# Altium schematic sheet core.SchDoc
size A4
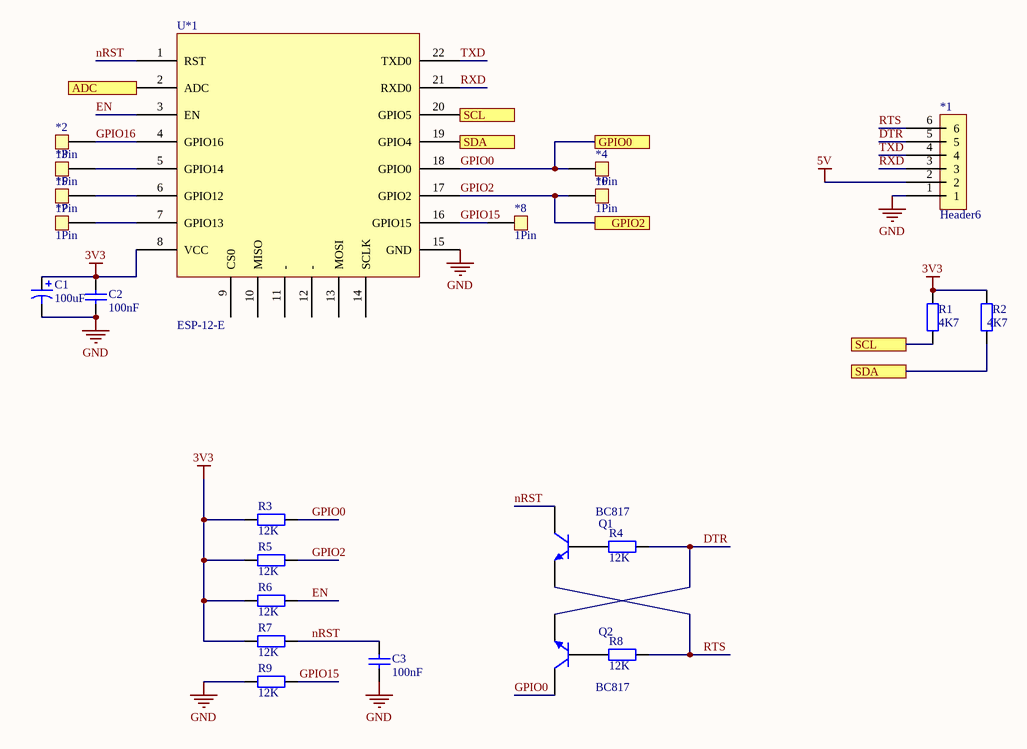
[diagram p0: core.SchDoc]

## Parts
*1  Header6  [HEADER6]
*2  1Pin  [Header1]
*3  1Pin  [Header1]
*4  1Pin  [Header1]
*5  1Pin  [Header1]
*6  1Pin  [Header1]
*7  1Pin  [Header1]
*8  1Pin  [Header1]
C1  100uF  [FP_3528]
C2  100nF  [FP_0805_CAP_085]
C3  100nF  [FP_0805_CAP_085]
Q1  BC817  [FP_SOT23-3]
Q2  BC817  [FP_SOT23-3]
R1  4K7  [FP_0805_RES]
R2  4K7  [FP_0805_RES]
R3  12K  [FP_0805_RES]
R4  12K  [FP_0805_RES]
R5  12K  [FP_0805_RES]
R6  12K  [FP_0805_RES]
R7  12K  [FP_0805_RES]
R8  12K  [FP_0805_RES]
R9  12K  [FP_0805_RES]
U*1  ESP-12-E  [ESP_12_E]

## Ports
ADC, GPIO0, GPIO2, SCL, SDA

## Nets
3V3: C1.P C2.2 R1.2 R2.2 R3.1 R5.1 R6.1 R7.1 U*1.8(VCC)
5V: *1.2
GND: *1.1 C1.N C2.1 C3.1 R9.1 U*1.15(GND)
ADC: U*1.2(ADC) ; port ADC
DTR: *1.5 Q2.2(E) R4.2
EN: R6.2 U*1.3(EN)
GPIO0: *4.1 Q2.3(C) R3.2 U*1.18(GPIO0) ; port GPIO0
GPIO2: *6.1 R5.2 U*1.17(GPIO2) ; port GPIO2
GPIO15: *8.1 R9.2 U*1.16(GPIO15)
GPIO16: *2.1 U*1.4(GPIO16)
nRST: C3.2 Q1.3(C) R7.2 U*1.1(RST)
RTS: *1.6 Q1.2(E) R8.2
RXD: *1.3 U*1.21(RXD0)
SCL: R1.1 U*1.20(GPIO5) ; port SCL
SDA: R2.1 U*1.19(GPIO4) ; port SDA
TXD: *1.4 U*1.22(TXD0)
Net*3_1: *3.1 U*1.5(GPIO14)
Net*5_1: *5.1 U*1.6(GPIO12)
Net*7_1: *7.1 U*1.7(GPIO13)
NetQ1_1: Q1.1(B) R4.1
NetQ2_1: Q2.1(B) R8.1

Not connected (* = marked no-connect by the designer): U*1 9(CS0) 10(MISO) 11(-) 12(-) 13(MOSI) 14(SCLK)

## Library data of the parts
C1 = CAP_ELECT: Polarized Capacitor; Value: 100uF
C2 = CAP: Capacitor; Value: 100nF
C3 = CAP 100nF: Capacitor; Tolerance: +80%/-20%; Voltage: 25V; Reference: 1759167; Name: SMD Multilayer Ceramic Capacitor, 0805; Supplier: Farnell; Value: 100nF
Q1 Q2 = BC817: NPN General-purpose Transistor; ComponentLink1Description: Manufacturer Link; ComponentLink1URL: http://www.semiconductors.philips.com/; ComponentLink2Description: Datasheet; ComponentLink2URL: http://www.semiconductors.philips.com/acrobat/datasheets/BC817_BC817W_BC337_5.pdf
R1 R2 = RES: Resistor; Value: 4K7
R3-R9 = RES 12K: Resistor; Tolerance: 5%; Power: 125mW; Name: YAGEO (PHYCOMP)  RC0805JR-0712KL  SMD Chip Resistor, Thick Film, 12 kohm; Reference: 9234144; Supplier: Farnell; Value: 12K
U*1 = ESP12-E